# Altium schematic sheet RC.SchDoc
size A4
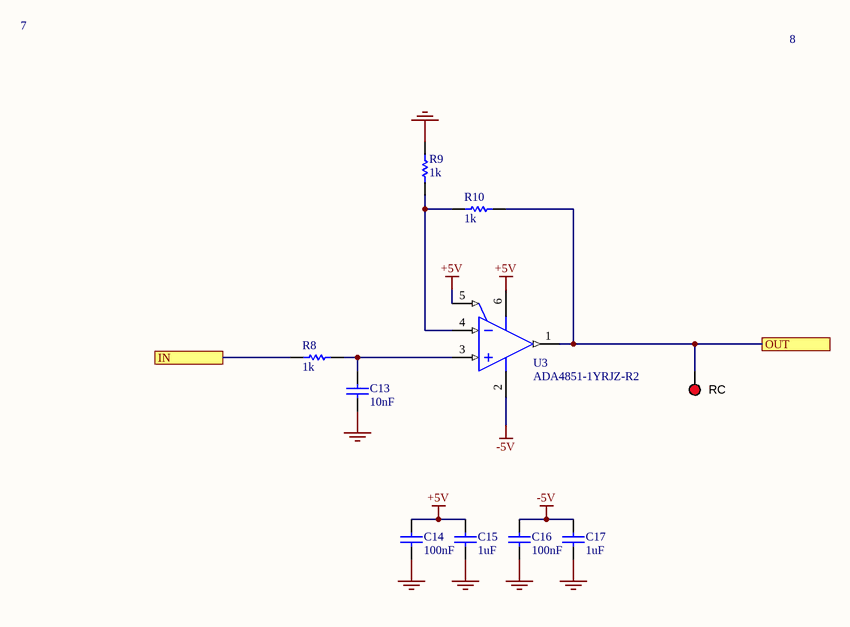
[diagram p0: RC.SchDoc]

## Parts
C13  10nF  [CAPC0603(1608)100_N]
C14  100nF  [CAPC0603(1608)100_N]
C15  1uF  [CAPC0603(1608)100_N]
C16  100nF  [CAPC0603(1608)100_N]
C17  1uF  [CAPC0603(1608)100_N]
R8  1k  [RESC0603(1608)_N]
R9  1k  [RESC0603(1608)_N]
R10  1k  [RESC0603(1608)_N]
RC  5010  [KSTN-5010_V]  (value not drawn)
U3  ADA4851-1YRJZ-R2  [ADI-RJ-6_N]

## Ports
IN, OUT

## Nets
+5V: C14.2 C15.2 U3.5(~{POWER_DOWN}) U3.6(+VS)
-5V: C16.2 C17.2 U3.2(-VS)
GND: C13.2 C14.1 C15.1 C16.1 C17.1 R9.1
IN: R8.2 ; port IN
OUT: R10.1 RC.1 U3.1(VOUT) ; port OUT
NetC13_1: C13.1 R8.1 U3.3(+IN)
NetR9_2: R9.2 R10.2 U3.4(-IN)

## Notes on the sheet
- 7
- 8

## Library data of the parts
C13 = CMP-1035-02589-1: 10nF Film; Value: 100nF; Case-EIA: 0603; Rated Voltage: 25 V; Tolerance: Â±20%; Case-Metric: 1608; Max Thickness: 1 mm; Technology: SMT
C14 C16 = CMP-1035-02589-1: CAP 100nF 25V ±20% 0603 (1608 Metric) Thickness 1mm SMD; Case-EIA: 0603; Tolerance: Â±20%; Case-Metric: 1608; Value: 100nF; Max Thickness: 1 mm; Technology: SMT; Rated Voltage: 25 V
C15 C17 = CMP-1035-02589-1: CAP 1uF 25V ±20% 0603 (1608 Metric) Thickness 1mm SMD; Value: 100nF; Case-EIA: 0603; Tolerance: Â±20%; Case-Metric: 1608; Max Thickness: 1 mm; Technology: SMT; Rated Voltage: 25 V
R8-R10 = CMP-1012-00397-1: 1k 1% Metal film; Value: 100.00 Ohm; Case-EIA: 0603; Power: 0.1 W; Case-Metric: 1608; Technology: SMT; Tolerance: 1 %
RC = CMP-1672-00002-3: Test Point, Red, Through Hole, RoHS, Bulk; REACH SVHC: No SVHC; Contact Material: Bronze; PackageDescription: 1-Pin Through Hole Device, Dia 3.17 mm; Mounting Technology: Through Hole; Colour: Red; PackageReference: 5010; Height: 8.12 mm; Pins: 1; RoHSCompliant: true; Package Quantity: 100; Packaging: Bulk; Mount: Through Hole; DatasheetVersion: Rev. F, 12/2013; Contact Plating: Silver
U3 = CMP-0384-01563-2: Single Channel Low Power Operational Amplifier, 130 MHz BW, 375 V/us SR, Industrial, 6-pin SOT23 (RJ-6), Reel; Manufacturer: Analog Devices; V Span Max: 12V; Amplifiers Per Package: 1; Iq/Amp: 3.2mA; Small Signal Bandwidth: 130MHz; Automotive Qualified: Yes; Input Offset Voltage: 600uV; Input Bias Current: 2.2uA; V Span Min: 2.7V; DatasheetVersion: Rev. J; PartNumber: ADA4851-1YRJZ-R2; ComponentLink2Description: Datasheet; ComponentLink1URL: http://www.analog.com/en/index.html; ComponentLink3URL: http://www.analog.com/static/imported-files/packages/PKG_PDF/SOT-23(RJ)/RJ_6.pdf; ComponentLink3Description: Package Specification; ComponentLink1Description: Manufacturer URL; Mounting Technology: Surface Mount; Code_JEDEC: MO-178-AB; Generic Part Number: ADA4851-1; PackageReference: RJ-6; RevisionNote: Reference Circuit URL fixed; ComponentLink4URL: http://www.analog.com/en/all-operational-amplifiers-op-amps/operational-amplifiers-op-amps/ada4851-1/products/product.html#product-recommendations; Slew Rate: 375V/us; ComponentLink4Description: Reference Circuit; ComponentLink2URL: http://www.analog.com/static/imported-files/data_sheets/ADA4851-1_4851-2_4851-4.pdf; PackageDescription: 6-Pin Small Outline Transistor Package, Body 2.9 x 1.6 mm, Pitch 0.95 mm; PackageVersion: 121608-A